# Altium schematic sheet Systemm_schematics.SchDoc
size A4
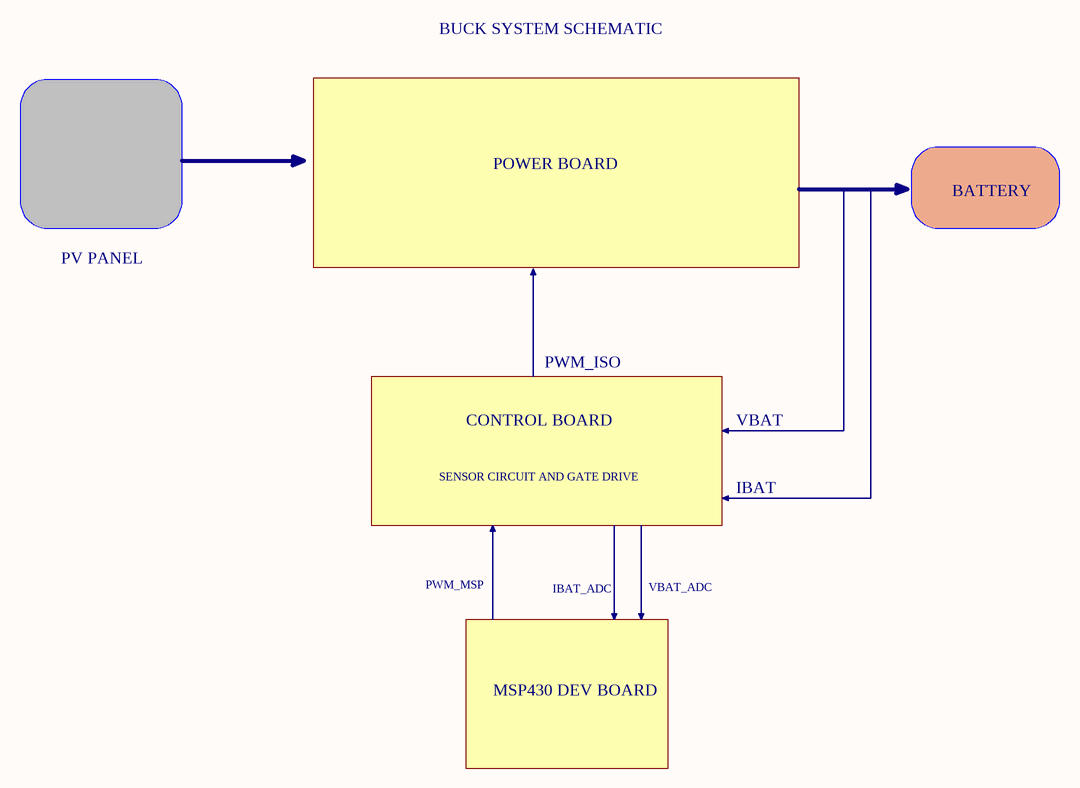
[diagram p0: Systemm_schematics.SchDoc]

## Notes on the sheet
- BUCK SYSTEM SCHEMATIC
- POWER BOARD
- BATTERY
- PV PANEL
- PWM_ISO
- CONTROL BOARD
- VBAT
- SENSOR CIRCUIT AND GATE DRIVE
- IBAT
- PWM_MSP
- IBAT_ADC
- VBAT_ADC
- MSP430 DEV BOARD